# Altium schematic sheet Sheet2.SchDoc
size A4; SheetNumber: 1; SheetTotal: 1
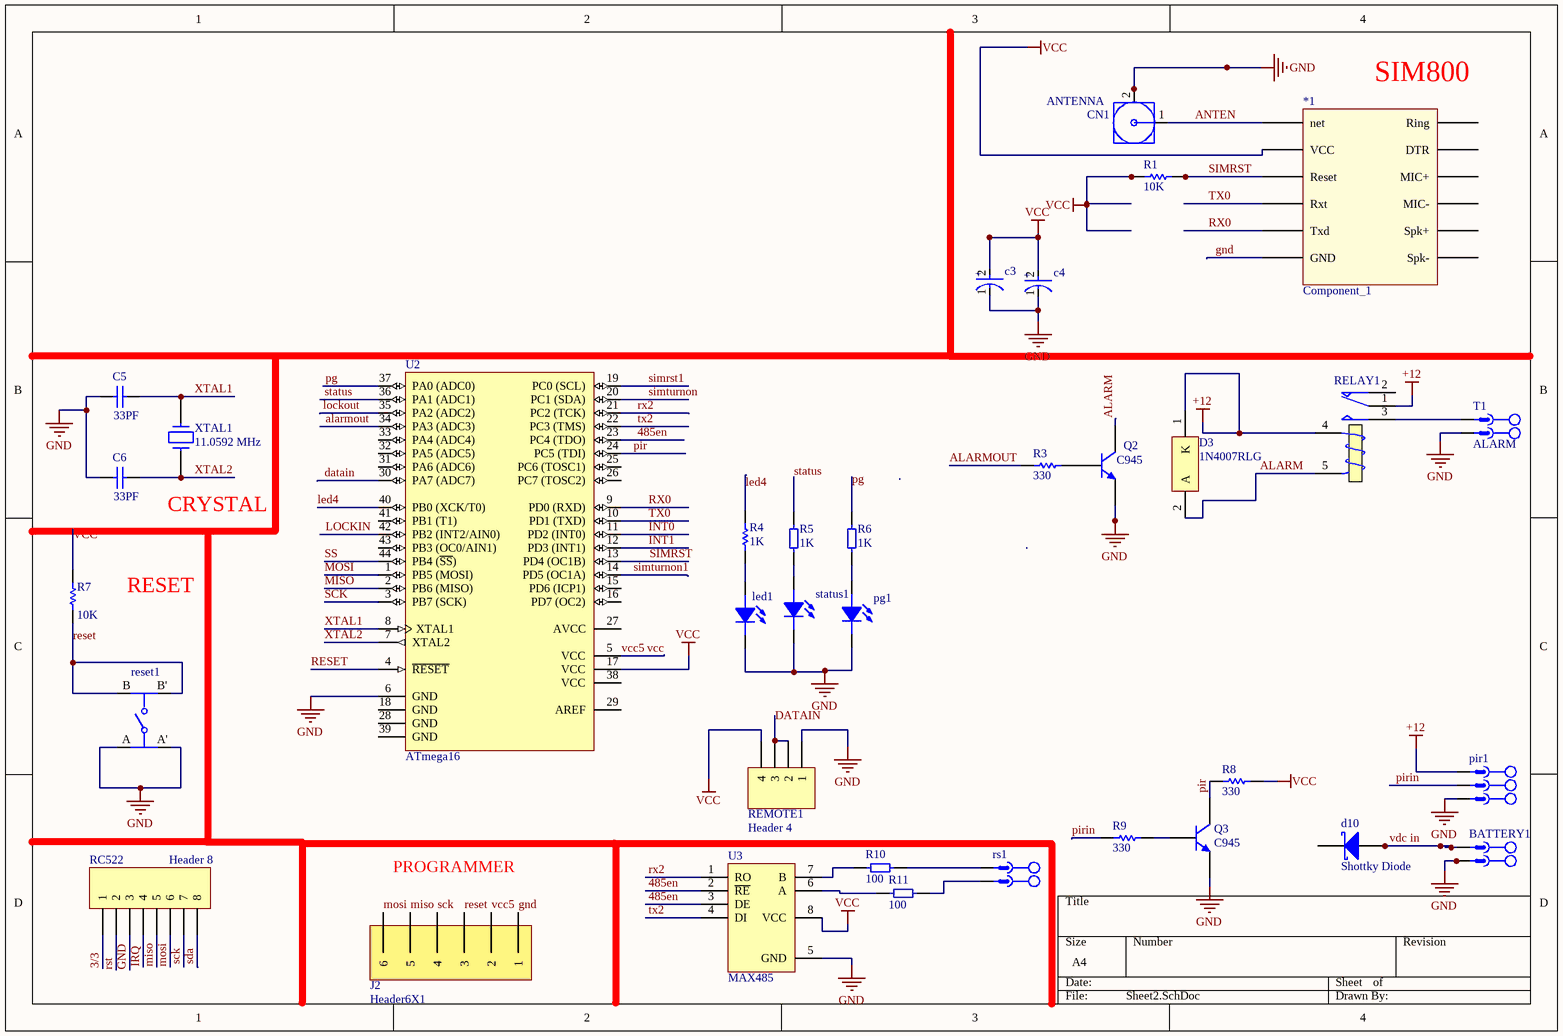
[diagram p0: Sheet2.SchDoc]

## Parts
*1  Component_1  [PCBComponent_1]
BATTERY1  PHOENIX  [MSTB 2,5/2-G-5,08]  (value not drawn)
c3  ECA1CM472  [FP-RAD-TH-D_16_0_5-L_25_2-MFG]  (value not drawn)
c4  ECA1CM472  [FP-RAD-TH-D_16_0_5-L_25_2-MFG]  (value not drawn)
C5  33PF  [RB.1/.3]
C6  33PF  [RB.1/.3]
CN1  ANTENNA  [SMA-Right]
D3  1N4007RLG  [ONSC-AXIAL_LEAD-2-59-10_P]
d10  Shottky Diode
J2  Header6X1  [HEADER 6X1]
led1  LED3MM  [LED3mm_GRN]  (value not drawn)
pg1  LED3MM  [LED3mm_GRN]  (value not drawn)
pir1  PHOENIX  [MSTB 2,5/3-G-5,08]  (value not drawn)
Q2  C945  [c945]
Q3  C945  [c945]
R1  value 10K  [AXIAL-0.3]  (hidden comment: Res1)
R3  value 330  [AXIAL-0.3]  (hidden comment: Res1)
R4  1K  [RESC4817X04N]
R5  Resistor SMD  [1206 Resistor]  (value not drawn)
R6  Resistor SMD  [1206 Resistor]  (value not drawn)
R7  value 10K  [AXIAL-0.3]  (hidden comment: Res1)
R8  value 330  [AXIAL-0.3]  (hidden comment: Res1)
R9  value 330  [AXIAL-0.3]  (hidden comment: Res1)
R10  Resistor SMD  [1812 Resistor]  (value not drawn)
R11  Resistor SMD  [1812 Resistor]  (value not drawn)
RC522  Header 8  [HDR1X8]
RELAY1  Relay  [Relay 15.40x12.10x13.10]  (value not drawn)
REMOTE1  Header 4  [HDR1X4]
reset1  EVQ-PAE09K  [FP-EVQ-PAE09K-MFG]  (value not drawn)
rs1  PHOENIX  [MSTB 2,5/2-G-5,08]  (value not drawn)
status1  LED3MM  [LED3mm_GRN]  (value not drawn)
T1  ALARM  [MSTB 2,5/2-G-5,08]
U2  ATmega16  [44A_M]
U3  MAX485  [SOIC-8]
XTAL1  11.0592 MHz  [My_Crystal]

## Nets
+12: D3.1(K) pir1.1 RELAY1.1(COM) RELAY1.4(T1)
gnd: *1.5(GND) BATTERY1.2 c3.1(C) c4.1(C) C5.1 C6.1 CN1.2(GND) J2.1 led1.2(CATHODE) pg1.2(CATHODE) pir1.3 Q2.2(E) Q3.2(E) RC522.3 REMOTE1.1 reset1.A reset1.A' status1.2(CATHODE) T1.2 U2.6(GND) U3.5(GND)
VCC: *1.1(VCC) c3.2(A) c4.2(A) J2.2 R1.2 R7.1 R8.1 REMOTE1.4 U2.5(VCC) U2.17(VCC) U3.8(VCC)  [also labelled vcc5]
3/3: RC522.1
485en: U2.23(PC4_(TDO)) U3.2(~{RE}) U3.3(DE)
ALARM: D3.2(A) Q2.3(C) RELAY1.5(T2)
ALARMOUT: R3.2 U2.34(PA3_(ADC3))
ANTEN: *1.0(net) CN1.1(ANT)
DATAIN: REMOTE1.2 REMOTE1.3 U2.30(PA7_(ADC7))
INT0: U2.11(PD2_(INT0))
INT1: U2.12(PD3_(INT1))
IRQ: RC522.4
led4: R4.2 U2.40(PB0_(XCK/T0))
LOCKIN: U2.42(PB2_(INT2/AIN0))
lockout: U2.35(PA2_(ADC2))
MISO: J2.5 RC522.5 U2.2(PB6_(MISO))
MOSI: J2.6 RC522.6 U2.1(PB5_(MOSI))
pg: R6.2 U2.37(PA0_(ADC0))
pir: Q3.3(C) R8.2 U2.24(PC5_(TDI))
pirin: pir1.2 R9.2
RESET: J2.3 R7.2 reset1.B reset1.B' U2.4(~{RESET})
rst: RC522.2
RX0: *1.4(Txd) U2.9(PD0_(RXD))
rx2: U2.21(PC2_(TCK)) U3.1(RO)
SCK: J2.4 RC522.7 U2.3(PB7_(SCK))
sda: RC522.8
SIMRST: *1.2(Reset) R1.1 U2.13(PD4_(OC1B))
simrst1: U2.19(PC0_(SCL))
simturnon: U2.20(PC1_(SDA))
simturnon1: U2.14(PD5_(OC1A))
SS: U2.44(PB4_(~{SS}))
status: R5.2 U2.36(PA1_(ADC1))
TX0: *1.3(Rxt) U2.10(PD1_(TXD))
tx2: U2.22(PC3_(TMS)) U3.4(DI)
vdc in: BATTERY1.1 d10.1(A)
XTAL1: C5.2 U2.8(XTAL1) XTAL1.2
XTAL2: C6.2 U2.7(XTAL2) XTAL1.1
Netled1_1: led1.1(ANODE) R4.1
Netpg1_1: pg1.1(ANODE) R6.1
NetQ2_1: Q2.1(B) R3.1
NetQ3_1: Q3.1(B) R9.1
NetR5_1: R5.1 status1.1(ANODE)
NetR10_1: R10.1 U3.7(B)
NetR10_2: R10.2 rs1.1
NetR11_1: R11.1 U3.6(A)
NetR11_2: R11.2 rs1.2
NetRELAY1_3: RELAY1.3(NO) T1.1

Not connected (* = marked no-connect by the designer): *1 6(Ring) 7(DTR) 8(MIC+) 9(MIC-) 10(Spk+) 11(Spk-); d10 2(K); RELAY1 2(NC); U2 15(PD6_(ICP1)) 16(PD7_(OC2)) 18(GND) 25(PC6_(TOSC1)) 26(PC7_(TOSC2)) 27(AVCC) 28(GND) 29(AREF) 31(PA6_(ADC6)) 32(PA5_(ADC5)) 33(PA4_(ADC4)) 38(VCC) 39(GND) 41(PB1_(T1)) 43(PB3_(OC0/AIN1))

## Notes on the sheet
- (near *1) SIM800
- CRYSTAL
- RESET
- PROGRAMMER
- (in symbol CMP-05427-001624-1) +
- (in symbol Resistor SMD) 100; 1K

## Library data of the parts
BATTERY1 rs1 T1 = CON_Phoenix_MSTB_02: 2 Pitch: 5.08 mm Color: green Contact surface: Tin Assembly; Manufacturer: PHOENIX CONTACT; Connector type: PCB Terminal Block; designer: ABBAS BASEREH; Max Current: 12 A; Positions: 2; Voltage: 320 V; Category: Connector; ComponentLink1Description: Header, Nominal current: 12 A Rated voltage (III/2): 320 V Number of positions: 2 Pitch: 5.08 mm Color: green Contact surface: Tin Assembly: Soldering  DESIGNER:ABBAS BASEREH; ComponentLink2Description: Reference; Mounting Technology: Through-Hole; Pin Count: 2; Revision 1: 2017-3-1; Status: Unreleased; PART.NO: PHOENIX
c3 c4 = CMP-05427-001624-1: Aluminum Electrolytic Capacitors (Radial Lead Type) 4700uF ±20% 16V; Lead Diameter: 0.8mm; Life (Hours): 2000Hour; Capacitance: 4.7mF; Polarity: Polar; Lead/Base Style: Straight; Leakage Current: 3uA; Ripple Current: 1.36A; Dielectric Material: Aluminium; Dissipation Factor: 0.26%; Length: 25mm; REACH SVHC: No SVHC; Package Quantity: 100; Height: 25mm; Voltage Rating: 16V; Mount: Through Hole; Case/Package: Radial; Max Operating Temperature: 85°C; Construction: RADIAL; Voltage: 16V; Series: M; RoHS Compliant: Yes; Height - Seated (Max): 1.063inch; Lead Free: Lead Free; Packaging: Bulk; Number of Pins: 2; Radiation Hardening: No; Diameter: 16mm; Voltage Rating (DC): 16V; Tolerance: 20%; Min Operating Temperature: -40°C; Termination: Radial; Lead Pitch: 7.5mm
C5 C6 = Cap Semi: Capacitor (Semiconductor SIM Model); Published: 8-Jun-2000; LatestRevisionDate: 29-May-2009; LatestRevisionNote: IPC-7351 Footprint Added.; PackageReference: C1206; Publisher: Altium Limited; PackageDescription: Chip Capacitor; Value: 33PF
D3 = CMP-0902-00147-1: Standard Recovery Rectifier, 2-Pin Axial_Lead, Pb-Free, Tape and Reel; Manufacturer: On Semiconductor; IO(rec) Max (A): 1; IFSM Max (A): 30; VRRM Max (V): 1000; ComponentLink2Description: Datasheet; Type: Standard Recovery; PackageDescription: 2-Pin, Axial Lead, Diameter 2.35 mm; ComponentLink2URL: http://www.onsemi.com/pub_link/Collateral/1N4001-D.PDF; RoHS: TRUE; DatasheetVersion: Rev. 13; Mounting Technology: Through Hole; ComponentLink1URL: http://www.onsemi.com/; ComponentLink1Description: Manufacturer URL; PackageReference: AXIAL_LEAD-2-59-10; ComponentLink3Description: Package Specification; Packing: Tape and Reel; PartNumber: 1N4007RLG; PackageVersion: Rev. U, 02/2005; ComponentLink3URL: http://www.onsemi.cn/pub_link/Collateral/59-10.PDF
led1 pg1 status1 = LED 3MM: Light Emitting Diode; Designer: Ali Hafizi
pir1 = CON_Phoenix_MSTB_03: 3 Pitch: 5.08 mm Color: green Contact surface: Tin Assembly; Manufacturer: PHOENIX CONTACT; Connector type: PCB Terminal Block; designer: ABBAS BASEREH; Max Current: 12 A; Positions: 3; Voltage: 320 V; Category: Connector; ComponentLink1Description: Header, Nominal current: 12 A Rated voltage (III/2): 320 V Number of positions: 3 Pitch: 5.08 mm Color: green Contact surface: Tin Assembly: Soldering  DESIGNER:ABBAS BASEREH; ComponentLink2Description: Reference; Mounting Technology: Through-Hole; Pin Count: 3; Revision 1: 2017-3-1; Status: Unreleased; PART.NO: PHOENIX
Q2 Q3 = C945: NPN Silicon Epitaxial Planar Transistor; pin to pad: 2>3 3>2; Published: 2017-2-8; LatestRevisionDate: 2017; LatestRevisionNote: IPC-7351 Footprint Added.; DatasheetVersion: 2017; PackageVersion: 2017-2-8; PackageReference: SOT23; Publisher: Abbas Basereh; PackageDescription: 3-Pin SOT-23 Package 0.95 mm Pitch, 2.3 mm Lead Span; ComponentLink1Description: Manufacturer Link; ComponentLink1URL: http://www.taitroncomponents.com/; ComponentLink2Description: Datasheet; ComponentLink2URL: http://www.taitroncomponents.com/
R1 R3 R7-R9 = Res1: Resistor; Published: 8-Jun-2000; LatestRevisionDate: 17-Jul-2002; LatestRevisionNote: Re-released for DXP Platform.; PackageReference: AXIAL-0.3; Publisher: Altium Limited; PackageDescription: Axial Device, Thru-Hole; 2 Leads; 0.3 in Pin Spacing
R4 = RES 1206 0.25W: RES 1206; Designer: Abbas Basereh; Desc.: RES SMD 1206; Data: 16-12-2016
RC522 = Header 8: Header, 8-Pin; LatestRevisionDate: 17-Jul-2002; LatestRevisionNote: Re-released for DXP Platform.; Publisher: Altium Limited
RELAY1 = RELAY General: Relay_SPDT POWER NEEDLE; Designer: Ali Hafizi; Company: E.P.I.L; Design_Date: 2011/10/31
REMOTE1 = Header 4: Header, 4-Pin; LatestRevisionDate: 17-Jul-2002; LatestRevisionNote: Re-released for DXP Platform.; Publisher: Altium Limited
reset1 = CMP-05618-000085-1: SWITCH TACTILE SPST-NO 0.02A 15V; Operating Force: 1.6N; Actuator Type: Standard; Current Rating: 20mA; Actuator Length: 5.6mm; Switch Function: Off-Mom; Illumination Type: Non-Illuminated; Actuator Color: Black; Throw Configuration: SPST; Contact Resistance: 50mR; Switch Travel: 0.25mm; Mechanical Life: 100000Cycles; Lead Free: Lead Free; Packaging: Bulk; Max Operating Temperature: 70°C; Height: 9.5mm; Width: 6mm; Series: EVQPA; Size: 6mm; Voltage Rating (DC): 15V; Mount: Through Hole; Contact Plating: Gold; Contact Current Rating: 20mA; RoHS Compliant: Yes; Color: Black; Depth: 7.8mm; Radiation Hardening: No; Length: 6mm; Max Voltage Rating (DC): 15V; Orientation: Straight; Termination: PC Pin; Max Current Rating: 20mA; Package Quantity: 500; Min Operating Temperature: -20°C; Electrical Life: 100000Cycles
U2 = CMP-0095-00235-2: 8-bit AVR Microcontroller, 4.5-5.5V, 16KB Flash, 512 Bytes EEPROM, 1KB SRAM, 44-pin TQFP, Industrial Grade (-40°C to 85°C), Pb-Free; ComponentLink3URL: http://www.atmel.com/dyn/resources/prod_documents/2466S.pdf; ComponentLink1URL: http://www.atmel.com/; ComponentLink1Description: Manufacturer URL; Code_JEDEC: MS-026-ACB; ComponentLink2URL: http://www.atmel.com/dyn/resources/prod_documents/doc2466.pdf; DatasheetVersion: revT, Jul-2010; ComponentLink2Description: ATmega16(L)  Datasheet; PackageReference: 44A; PackageDescription: 44-Pin Plastic Thin Profile Quad Flat Pack, 10 x 10 x 1.0 mm Body, 0.8 mm Pitch (TQFP); RevisionNote: DatasheetVersion & PackageVersion updated. URLs added.; ComponentLink3Description: ATmega16(L) Summary; PackageVersion: revC, Oct-2010
XTAL1 = CRYSTAL